# Altium schematic sheet LPCB235 - CAN Interface.SchDoc
size A3; Address1: Unit 4; DocumentNumber: 22; Revision: 2; SheetNumber: 22; SheetTotal: 37; Lockie__PCB_SUB_ASSEMBLY: CAN Interface; Lockie__PCB_ASSEMBLY: FCU PCB; Lockie__LDL: LPCB235; Lockie__PCB_DESCRIPTION: Flight Control Unit
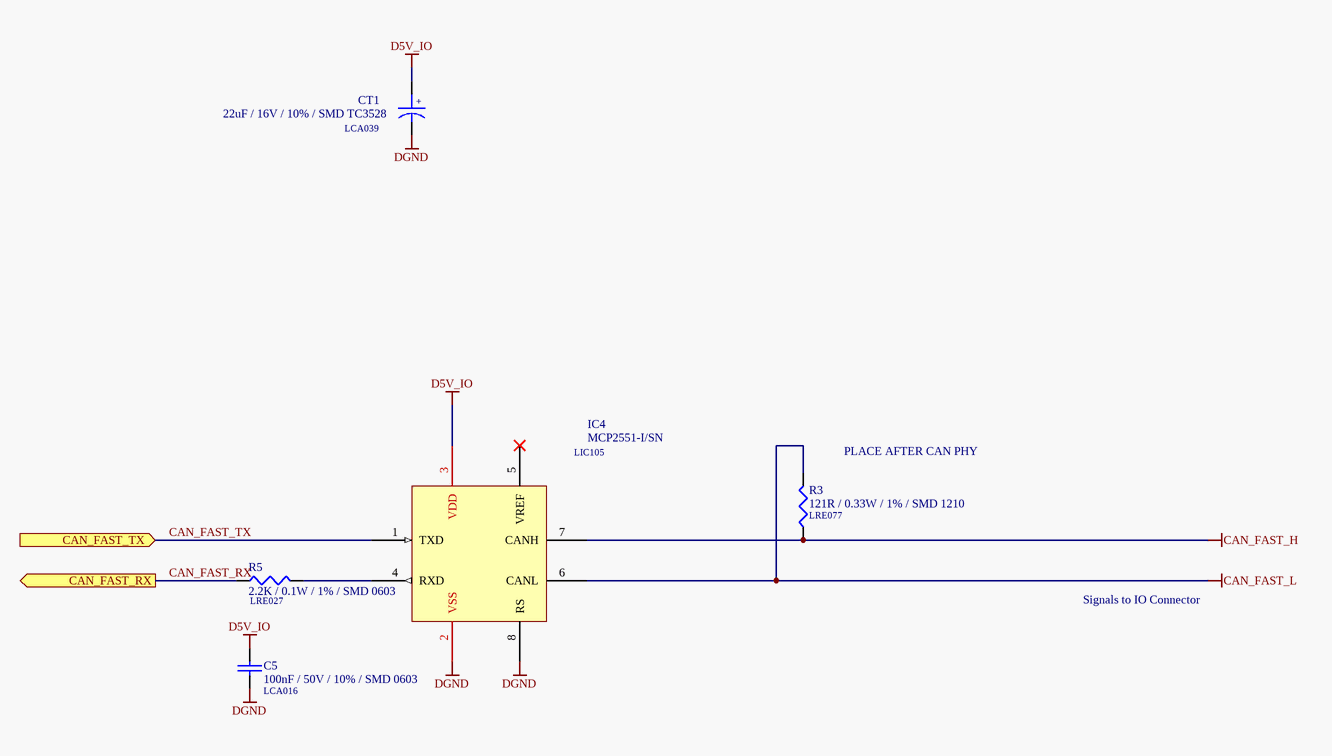
[diagram p0: LPCB235 - CAN Interface.SchDoc]

## Parts
C5  100nF / 50V / 10% / SMD 0603  LDL_NUMBER: LCA016  [LFP011__CC1608-0603-IPC7351_B]
CT1  22uF / 16V / 10% / SMD TC3528  LDL_NUMBER: LCA039  [LFP018__TC3528]
IC4  MCP2551-I/SN  LDL_NUMBER: LIC105  [LFP017__SO-G8/Y1.9]
R3  121R / 0.33W / 1% / SMD 1210  LDL_NUMBER: LRE077  [LFP028__CR3225-1210]
R5  2.2K / 0.1W / 1% / SMD 0603  LDL_NUMBER: LRE027  [LFP020__CR1608-0603-IPC7351_B]

## Ports
CAN_FAST_RX (out), CAN_FAST_TX (in)

## Nets
CAN_FAST_H: IC4.7(CANH) R3.1
CAN_FAST_L: IC4.6(CANL) R3.2
D5V_IO: C5.1 CT1.1 IC4.3(VDD)
DGND: C5.2 CT1.2 IC4.2(VSS) IC4.8(RS)
CAN_FAST_RX: R5.1 ; port CAN_FAST_RX
CAN_FAST_TX: IC4.1(TXD) ; port CAN_FAST_TX
NetIC4_4: IC4.4(RXD) R5.2

Not connected (* = marked no-connect by the designer): IC4 5(VREF)*

## Notes on the sheet
- (near R3) PLACE AFTER CAN PHY
- Signals to IO Connector
- PCB COMPONENT DESCRIPTION
- LDL NUMBER
- Assembly Details
- Size
- Drawing File Name
- Revision
- http://rloop.org
- Scale
- A3
- Sheet Details
- N.T.S
- Sheet:
- Of:
- (in symbol 22uF / 16V / 10% / SMD TC3528) +

## Library data of the parts
C5 = 100nF / 50V / 10% / SMD 0603: Capacitor, Ceramic Chip, 100nF (0.1uF), 50V, 5%, SMD 0603 [LCA016]; Value: 100n; FMEDA__OPERATING__VOLTAGE_MIN: 0; FMEDA__OPERATING__VOLTAGE_MAX: 3.3; FMEDA__OPERATING__TEMP_MIN: -20; FMEDA__OPERATING__TEMP_TYP: 27; FMEDA__OPERATING__TEMP_MAX: 50; FMEDA__CHANNEL: COM; FMEDA__FUNCTION_IN_SYSTEM: *; FMEDA__OPERATING__VOLTAGE_TYP: 3.3
CT1 = 22uF / 16V / 10% / SMD TC3528: Capacitor, Tantalum, 22uF, 16V, 10%, SMD TC3528 (BCASE) [LCA039]; Value: 22u; FMEDA__OPERATING__VOLTAGE_MAX: 3.3; FMEDA__OPERATING__VOLTAGE_MIN: 0; FMEDA__OPERATING__TEMP_MAX: 50; FMEDA__OPERATING__TEMP_MIN: -20; FMEDA__OPERATING__TEMP_TYP: 27; FMEDA__FUNCTION_IN_SYSTEM: CAN PHY BYPASS CAP; FMEDA__CHANNEL: COM; FMEDA__OPERATING__VOLTAGE_TYP: 3.3
IC4 = MCP2551-I/SN: IC, High Speed CAN Transceiver, SMD SOIC8 [LIC105]; FMEDA__OPERATING__TEMP_MAX: 50; FMEDA__OPERATING__TEMP_MIN: -20; FMEDA__OPERATING__TEMP_TYP: 27; FMEDA__OPERATING__VOLTAGE_MAX: 0; FMEDA__FUNCTION_IN_SYSTEM: CAN PHY 1; FMEDA__CHANNEL: COM; FMEDA__OPERATING__VOLTAGE_MIN: 0; FMEDA__OPERATING__VOLTAGE_TYP: 0
R3 = 121R / 0.33W / 1% / SMD 1210: Resistor, Ceramic Chip, 121R, 0.33W, 1%, SMD 1210 [LRE077]; VALUE: 121; FMEDA__OPERATING__POWER_MAX: 0; FMEDA__OPERATING__TEMP_MAX: 50; FMEDA__OPERATING__TEMP_MIN: -20; FMEDA__OPERATING__TEMP_TYP: 27; FMEDA__CHANNEL: COM; FMEDA__OPERATING__POWER_MIN: 0; FMEDA__OPERATING__VOLTAGE_MAX: 0; FMEDA__OPERATING__VOLTAGE_MIN: 0; FMEDA__OPERATING__VOLTAGE_TYP: 0; FMEDA__FUNCTION_IN_SYSTEM: *
R5 = 2.2K / 0.1W / 1% / SMD 0603: Resistor, Ceramic Chip, 2.2K, 0.1W, 1%, SMD 0603 [LRE027]; FMEDA__OPERATING__VOLTAGE_MIN: 0; FMEDA__FUNCTION_IN_SYSTEM: CAN PHY 1 ILIM; FMEDA__OPERATING__TEMP_MIN: -20; FMEDA__OPERATING__TEMP_TYP: 27; FMEDA__OPERATING__TEMP_MAX: 50; FMEDA__CHANNEL: COM; VALUE: 2.2K; FMEDA__OPERATING__VOLTAGE_MAX: 0; FMEDA__OPERATING__POWER_MIN: 0; FMEDA__OPERATING__POWER_MAX: 0; FMEDA__OPERATING__VOLTAGE_TYP: 0